# EAGLE schematic 10125624A00 (EAGLE 6.4)

## Sheet 1 of 2
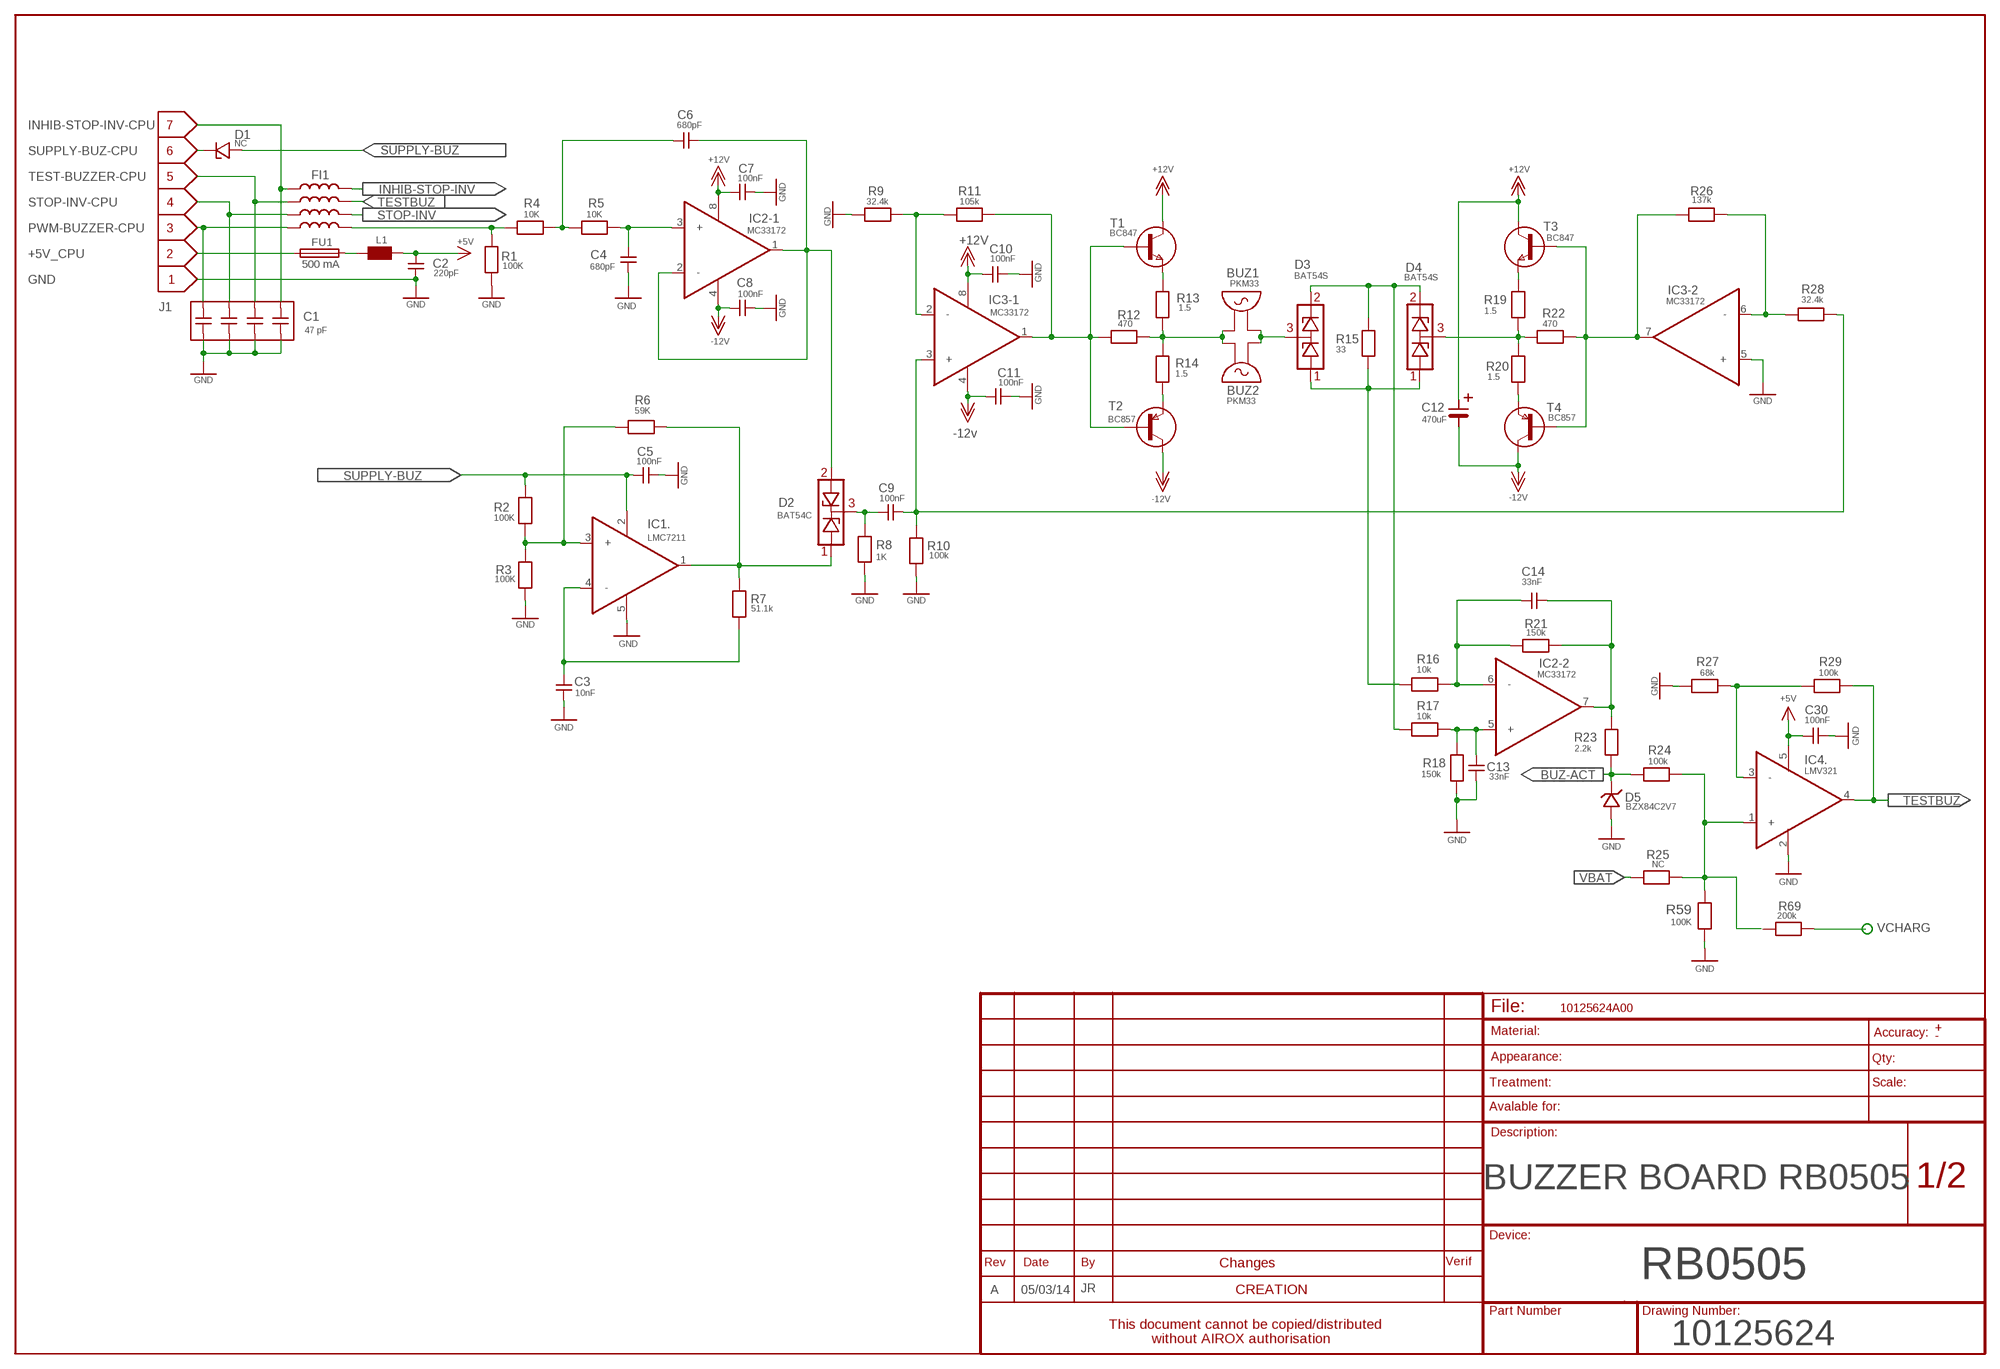
[diagram p0: schematic, sheet 1]

### Parts
BUZ1  PKM33  [PKM33]
BUZ2  PKM33  [PKM33]
C1  47 pF  RESEAU_4C  [RESEAU_1]
C2  220pF  C0805  [C0805]
C3  10nF  C0805  [C0805]
C4  680pF  C0603  [C0603]
C5  100nF  C0805  [C0805]
C6  680pF  C0603  [C0603]
C7  100nF  C0603  [C0603]
C8  100nF  C0603  [C0603]
C9  100nF  C0805  [C0805]
C10  100nF  C0603  [C0603]
C11  100nF  C0603  [C0603]
C12  470uF  MV100F50V  [MV100?F]
C13  33nF  C0805  [C0805]
C14  33nF  C0805  [C0805]
C30  100nF  C0805  [C0805]
D1  NC  PRLL5819  [SOD87]
D2  BAT54C  [SOT23_DI]
D3  BAT54S  [SOT23DIO]
D4  BAT54S  [SOT23DIO]
D5  BZX84C2V7  BZX84CXX  [SOT23DIO]
FI1  WE-FA  [WE-FA]
FU1  500 mA  SLOBLO  [SLOBLO]
IC1  LMC7211  [SOT23-5]
IC2  MC33172  OPA2604  [SO8]
IC3  MC33172  OPA2604  [SO8]
IC4  LMV321  [SOT23-5]
J1  B7B_ZR_SM3_TF  [7B_ZR_SM3_TF]
L1  742792  [0805]
R1  100K  R0805  [R0805]
R2  100K  R0805  [R0805]
R3  100K  R0805  [R0805]
R4  10K  R0805  [R0805]
R5  10K  R0805  [R0805]
R6  59K  R0805  [R0805]
R7  51.1k  R0805  [R0805]
R8  1K  R0805  [R0805]
R9  32.4k  R0805  [R0805]
R10  100k  R0805  [R0805]
R11  105k  R0805  [R0805]
R12  470  R0805  [R0805]
R13  1.5  R0805  [R0805]
R14  1.5  R0805  [R0805]
R15  33  R0805  [R0805]
R16  10k  R0805  [R0805]
R17  10k  R0805  [R0805]
R18  150k  R0805  [R0805]
R19  1.5  R0805  [R0805]
R20  1.5  R0805  [R0805]
R21  150k  R0805  [R0805]
R22  470  R0805  [R0805]
R23  2.2k  R0805  [R0805]
R24  100k  R0805  [R0805]
R25  NC  R0805  [R0805]
R26  137k  R0805  [R0805]
R27  68k  R0805  [R0805]
R28  32.4k  R0805  [R0805]
R29  100k  R0805  [R0805]
R59  100K  R0805  [R0805]
R69  200k  R0805  [R0805]
T1  BC847  [SOT23]
T2  BC857  BC547  [SOT23]
T3  BC847  [SOT23]
T4  BC857  BC547  [SOT23]

### Nets
+5V: C2.2 C30.1 IC4.5(1:VCC) L1.2 ; also sheet 2
+5V_CPU: FU1.1 J1.2
+12V: C7.1 C10.2 C12.+ IC2.8(VCC) IC3.8(VCC) T1.C T3.C ; also sheet 2
-12V: C8.1 C11.2 C12.- IC2.4(GND) IC3.4(GND) T2.C T4.C ; supply symbol labelled -12v ; also sheet 2
BUZ-ACT: D5.3(K) R23.2 R24.2 ; also sheet 2
GND: C1.1 C1.2 C1.3 C1.4 C2.1 C3.1 C4.2 C5.2 C7.2 C8.2 C10.1 C11.1 C13.2 C30.2 D5.1(A) IC1.5(GND) IC3.5(-2:+) IC4.2(1:GND) J1.1 R1.1 R3.1 R8.2 R9.1 R10.1 R18.1 R27.2 R59.1 ; also sheet 2
INHIB-STOP-INV: FI1.L4A ; also sheet 2
INHIB-STOP-INV-CPU: C1.8 FI1.L4B J1.7
N$2: IC3.1(-1:OUT) R11.2 R12.1 T1.B T2.B
N$3: IC3.2(-1:-) R9.2 R11.1
N$4: C9.2 D2.3 R8.1
N$5: FU1.2 L1.1
N$7: D4.3 R19.1 R20.2 R22.1
N$11: C3.2 IC1.4(.:-) R7.1
N$12: IC3.6(-2:-) R26.2 R28.1
N$13: IC1.3(.:+) R2.1 R3.2 R6.1
N$14: IC3.7(-2:OUT) R22.2 R26.1 T3.B T4.B
N$15: R19.2 T3.E
N$16: R13.2 T1.E
N$17: R14.1 T2.E
N$18: R20.1 T4.E
N$19: BUZ1.IN- BUZ2.IN- R12.2 R13.1 R14.2
N$21: C9.1 IC3.3(-1:+) R10.2 R28.2
N$24: D3.2 D4.2 R15.2 R17.1
N$25: C14.1 IC2.6(-2:-) R16.2 R21.1
N$26: C13.1 IC2.5(-2:+) R17.2 R18.2
N$27: IC4.3(.:-) R27.1 R29.2
N$28: C14.2 IC2.7(-2:OUT) R21.2 R23.1
N$30: D2.1 IC1.1(.:OUT) R6.2 R7.2
N$31: BUZ1.IN+ BUZ2.IN+ D3.3
N$32: D3.1 D4.1 R15.1 R16.1
N$35: C6.1 D2.2 IC2.1(-1:OUT) IC2.2(-1:-)
N$37: C4.1 IC2.3(-1:+) R5.1
N$39: C6.2 R4.1 R5.2
N$45: IC4.1(.:+) R24.1 R25.1 R59.2
PWM-BUZ: FI1.L1A R1.2 R4.2
PWM-BUZZER-CPU: C1.5 FI1.L1B J1.3
STOP-INV: FI1.L2A ; also sheet 2
STOP-INV-CPU: C1.6 FI1.L2B J1.4
SUPPLY-BUZ: C5.1 D1.A IC1.2(VCC) R2.2 ; also sheet 2
SUPPLY-BUZ-CPU: D1.K J1.6
TEST-BUZZER-CPU: C1.7 FI1.L3B J1.5
TESTBUZ: FI1.L3A IC4.4(.:OUT) R29.1
VBAT: R25.2 ; also sheet 2
VCHARG: R69.1 ; also sheet 2
Unconnected: R69.2

### Notes on the sheet
- BUZZER BOARD RB0505
- RB0505
- A | 05/03/14 | JR
- 10125624

## Sheet 2 of 2
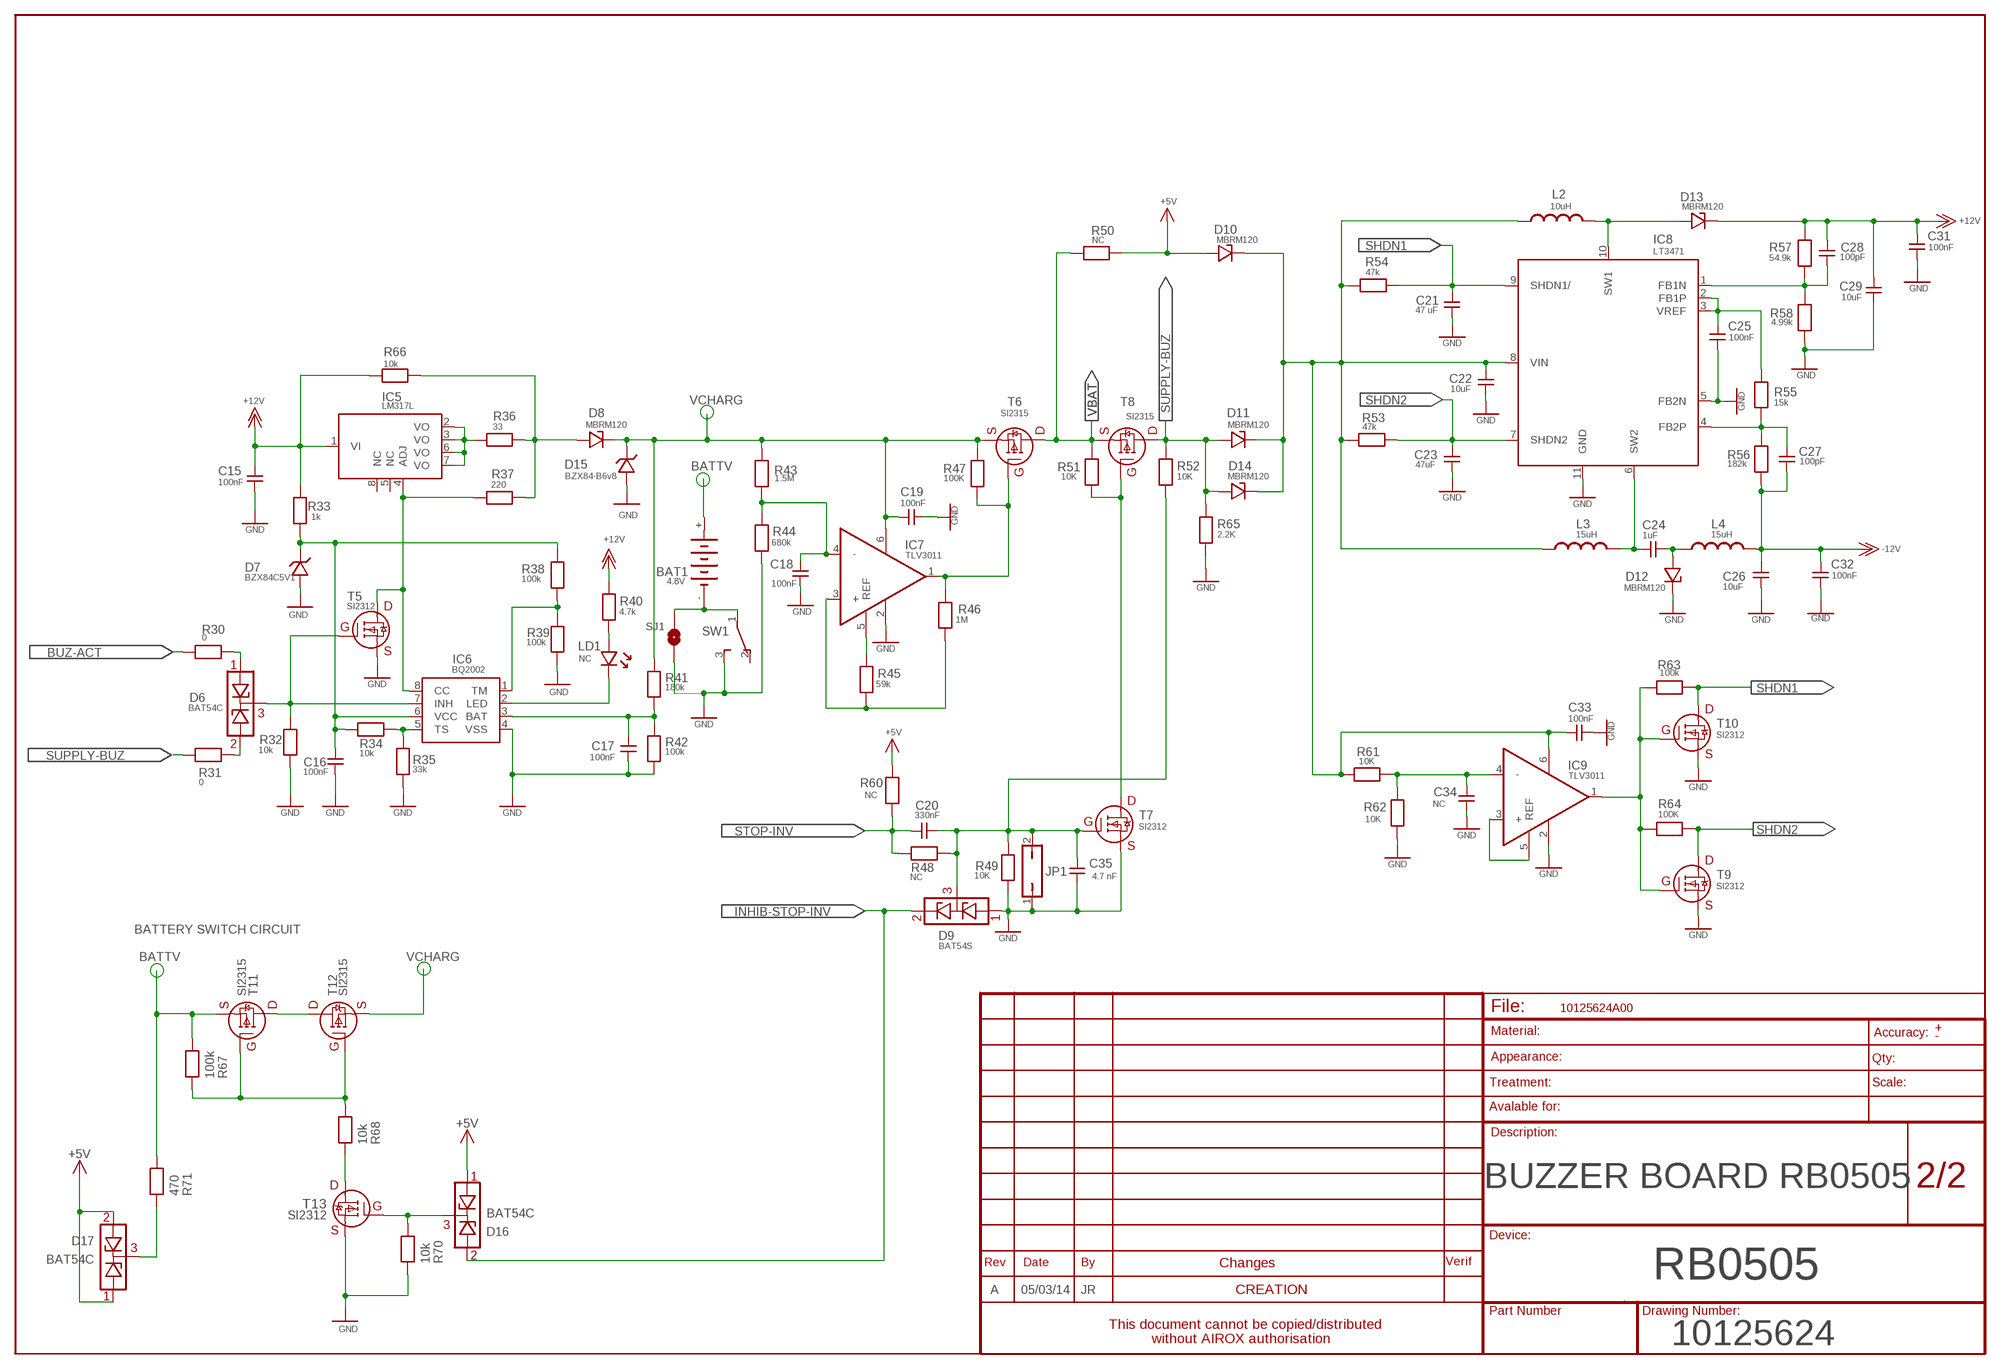
[diagram p1: schematic, sheet 2]

### Parts
BAT1  4.8V  4V110R  [4V110R]
C15  100nF  C0805  [C0805]
C16  100nF  C0805  [C0805]
C17  100nF  C0805  [C0805]
C18  100nF  C0805  [C0805]
C19  100nF  C0805  [C0805]
C20  330nF  C0805  [C0805]
C21  47 uF  C0805  [C0805]
C22  10uF  C0805  [C0805]
C23  47uF  C0805  [C0805]
C24  1uF  C0805  [C0805]
C25  100nF  C0805  [C0805]
C26  10uF  C0805  [C0805]
C27  100pF  C0805  [C0805]
C28  100pF  C0805  [C0805]
C29  10uF  C0805  [C0805]
C31  100nF  C0805  [C0805]
C32  100nF  C0805  [C0805]
C33  100nF  C0805  [C0805]
C34  NC  C0805  [C0805]
C35  4.7 nF  C0805  [C0805]
D6  BAT54C  [SOT23_DI]
D7  BZX84C5V1  BZX84CXX  [SOT23DIO]
D8  MBRM120  PRLL5819  [SOD87]
D9  BAT54S  [SOT23DIO]
D10  MBRM120  PRLL5819  [SOD87]
D11  MBRM120  PRLL5819  [SOD87]
D12  MBRM120  PRLL5819  [SOD87]
D13  MBRM120  PRLL5819  [SOD87]
D14  MBRM120  PRLL5819  [SOD87]
D15  BZX84-B6v8  BZX84CXX  [SOT23DIO]
D16  BAT54C  [SOT23_DI]
D17  BAT54C  [SOT23_DI]
IC5  LM317L  [SO8]
IC6  BQ2002  [SO8]
IC7  TLV3011  [SOT23-6]
IC8  LT3471  [DFN10]
IC9  TLV3011  [SOT23-6]
JP1  JP1Q  [JP1]
L2  10uH  WE-TPC-MH  [WE-TPC-MH]
L3  15uH  WE-TPC-MH  [WE-TPC-MH]
L4  15uH  WE-TPC-MH  [WE-TPC-MH]
LD1  NC  LED3  [LED3]
R30  0  R0805  [R0805]
R31  0  R0805  [R0805]
R32  10k  R0805  [R0805]
R33  1k  R0805  [R0805]
R34  10k  R0805  [R0805]
R35  33k  R0805  [R0805]
R36  33  R0805  [R0805]
R37  220  R0805  [R0805]
R38  100k  R0805  [R0805]
R39  100k  R0805  [R0805]
R40  4.7k  R0805  [R0805]
R41  180k  R0805  [R0805]
R42  100k  R0805  [R0805]
R43  1.5M  R0805  [R0805]
R44  680k  R0805  [R0805]
R45  59k  R0805  [R0805]
R46  1M  R0805  [R0805]
R47  100K  R0805  [R0805]
R48  NC  R0805  [R0805]
R49  10K  R0805  [R0805]
R50  NC  R0805  [R0805]
R51  10K  R0805  [R0805]
R52  10K  R0805  [R0805]
R53  47k  R0805  [R0805]
R54  47k  R0805  [R0805]
R55  15k  R0805  [R0805]
R56  182k  R0805  [R0805]
R57  54.9k  R0805  [R0805]
R58  4.99k  R0805  [R0805]
R60  NC  R0805  [R0805]
R61  10K  R0805  [R0805]
R62  10K  R0805  [R0805]
R63  100k  R0805  [R0805]
R64  100K  R0805  [R0805]
R65  2.2K  R0805  [R0805]
R66  10k  R0805  [R0805]
R67  100k  R0805  [R0805]
R68  10k  R0805  [R0805]
R70  10k  R0805  [R0805]
R71  470  R0805  [R0805]
SJ1  SJW  [SJW]
SW1  NK236  [NK236]
T5  SI2312  IRLML2803  [SOT23MOS]
T6  SI2315  IRLML5103  [SOT23MOS]
T7  SI2312  IRLML2803  [SOT23MOS]
T8  SI2315  IRLML5103  [SOT23MOS]
T9  SI2312  IRLML2803  [SOT23MOS]
T10  SI2312  IRLML2803  [SOT23MOS]
T11  SI2315  IRLML5103  [SOT23MOS]
T12  SI2315  IRLML5103  [SOT23MOS]
T13  SI2312  IRLML2803  [SOT23MOS]

### Nets
+5V: D10.A D16.1 D17.1 D17.2 R50.2 R60.2 ; also sheet 1
+12V: C15.2 C28.2 C29.2 C31.2 D13.K IC5.1(VI) R33.2 R40.1 R57.1 R66.2 ; also sheet 1
-12V: C26.1 C27.1 C32.2 L4.2 R56.2 ; also sheet 1
BATTV: R67.2 R71.2 T11.S
BUZ-ACT: R30.1 ; also sheet 1
GND: C15.1 C16.2 C17.1 C18.2 C19.2 C21.1 C22.2 C23.1 C25.1 C26.2 C29.1 C31.1 C32.1 C33.2 C34.1 C35.1 D7.1(A) D9.1 D12.K D15.1(A) IC6.4(VSS) IC7.2(VSS) IC8.5(FB2N) IC8.11(GND) IC9.2(VSS) JP1.1 R32.1 R35.1 R39.1 R42.2 R44.1 R49.1 R58.2 R62.1 R65.1 R70.1 SJ1.1 SW1.3 T5.S T7.S T9.S T10.S T13.S ; also sheet 1
GT1: C20.1 C35.2 D9.3 JP1.2 R48.2 R49.2 R52.1 T7.G
INHIB-STOP-INV: D9.2 D16.2 ; also sheet 1
N$1: IC5.2(VO) IC5.3(VO) IC5.6(VO) IC5.7(VO) R36.2
N$6: D8.A R36.1 R37.1 R66.1
N$8: IC9.3(+) IC9.5(REF)
N$9: C34.2 IC9.4(-) R61.1 R62.2
N$10: C22.1 C33.1 D10.K D11.K D14.K IC8.8(VIN) IC9.6(VCC) L2.1 L3.1 R53.1 R54.1 R61.2
N$20: BAT1.- SJ1.2 SW1.1
N$22: IC9.1(OUT) R63.1 R64.1 T9.G T10.G
N$23: IC5.4(ADJ) IC6.8(CC) R37.2 T5.D
N$29: T11.D T12.D
N$33: C17.2 IC6.3(BAT) R41.2 R42.1
N$34: D17.3 R71.1
N$36: D6.3 IC6.7(INH) R32.2 T5.G
N$38: IC7.3(+) R45.1 R46.1
N$40: IC6.1(TM) R38.1 R39.2
N$41: R51.1 T7.D T8.G
N$42: D13.A IC8.10(SW1) L2.2
N$43: R67.1 R68.2 T11.G T12.G
N$44: R68.1 T13.D
N$46: C24.2 IC8.6(SW2) L3.2
N$47: C24.1 D12.A L4.1
N$48: C27.2 IC8.4(FB2P) R55.2 R56.1
N$49: D6.2 R31.2
N$50: C25.2 IC8.2(FB1P) IC8.3(VREF) R55.1
N$51: C28.1 IC8.1(FB1N) R57.2 R58.1
N$52: D6.1 R30.2
N$53: D16.3 R70.2 T13.G
N$54: IC6.5(TS) R34.1 R35.2
N$55: LD1.A R40.2
N$56: IC7.1(OUT) R46.2 R47.1 T6.G
N$57: C18.1 IC7.4(-) R43.1 R44.2
N$58: C16.1 D7.3(K) IC6.6(VCC) R33.1 R34.2 R38.2
N$59: IC7.5(REF) R45.2
N$78: IC6.2(LED) LD1.K
SHDN1: C21.2 IC8.9(SHDN1/) R54.2 R63.2 T10.D
SHDN2: C23.2 IC8.7(SHDN2) R53.2 R64.2 T9.D
STOP-INV: C20.2 R48.1 R60.1 ; also sheet 1
SUPPLY-BUZ: D11.A D14.A R31.1 R52.2 R65.2 T8.D ; also sheet 1
VBAT: R50.1 R51.2 T6.D T8.S ; also sheet 1
VCHARG: C19.1 D8.K D15.3(K) IC7.6(VCC) R41.1 R43.2 R47.2 T6.S T12.S ; also sheet 1
Unconnected: BAT1.+ BAT1.+@1(+) IC5.5(NC) IC5.8(NC) SW1.2

### Notes on the sheet
- BATTERY SWITCH CIRCUIT
- BUZZER BOARD RB0505
- RB0505
- A | 05/03/14 | JR
- 10125624

## Library data of the parts
BAT1 = BATTERY:4V110R: NC ACCU Varta
BUZ1 BUZ2 = BUZZER:PKM33
C1 = CONDENSA:RESEAU_4C
C2 C3 C5 = CONDENSA:C0805
C4 C6-C8 C10 C11 = CONDENSAT_CMS:C0603
C9 C13 C14 C16 C21-C32 = CONDENSAT_CMS:C0805
C12 = CONDENSAT_CMS:MV100?F50V
C15 C17-C20 C33-C35 = CONDENSA@4:C0805
D1 D8 D10-D14 = TRANSIST_DIOD_CMS:PRLL5819
D2 D6 D16 D17 = TRANSIST_DIOD_CMS:BAT54C
D3 D4 D9 = TRANSIST_DIOD_CMS:BAT54S
D5 D7 D15 = TRANSIST_DIOD_CMS:BZX84CXX
FI1 = FILTRE:WE-FA
FU1 = FUSE:SLOBLO
IC1 = CI_ANAL:LMC7211
IC2 IC3 = CI_ANAL:OPA2604
IC4 = CI_ANAL:LMV321
IC5 = CI_ANAL:LM317L
IC6 = CI_ANAL:BQ2002
IC7 IC9 = CI_ANAL:TLV3011
IC8 = CI2:LT3471
J1 = Connecteur_cms:B7B_ZR_SM3_TF
JP1 = JUMPS:JP1Q
L1 = SELF:742792
L2-L4 = SELF:WE-TPC-MH
LD1 = TRANSIST_DIOD_CMS:LED3
R1 R4 R5 R9-R29 R53-R59 R69 = RESIST_CMS:R0805
R2 R3 R6-R8 R30-R52 R60-R68 R70 R71 = RESIST_C:R0805
SJ1 = JUMPER:SJW
SW1 = SWITCH:NK236
T1 T3 = TRANSIST_DIOD_CMS:BC847
T2 T4 = TRANSIST_DIOD_CMS:BC547
T5 T7 T9 T10 T13 = TRANSIST:IRLML2803
T6 T8 T11 T12 = TRANSIST@2:IRLML5103